# Altium project elevator.PrjPcb
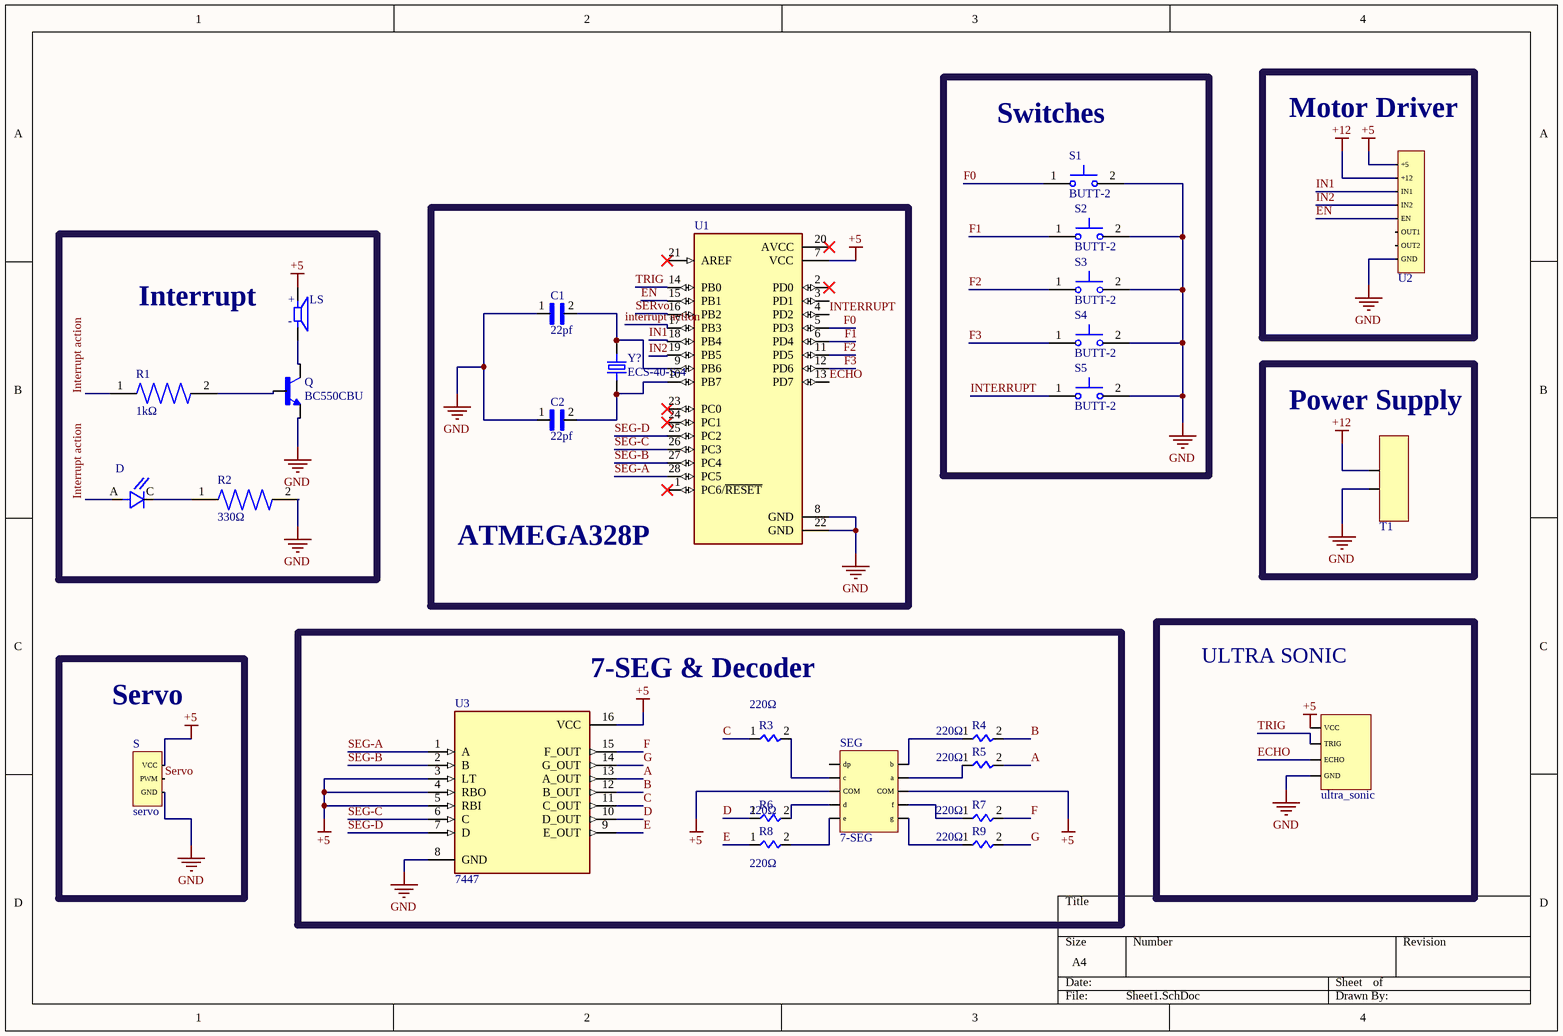
[diagram p0: Sheet1.SchDoc]
1 sheet, 27 parts. Net scope: global (net labels, ports and power ports of the same name join across sheets).
Board file: PCB1.PcbDoc

## Sheet Sheet1.SchDoc
size A4; SheetNumber: 1; SheetTotal: 1

### Parts
C1  22pf  [CAP_RCE5C2A220J0A2H03B]
C2  22pf  [CAP_RCE5C2A220J0A2H03B]
D  OVLAW4CB7  [LEDRD254W50D305H520P]  (value not drawn)
LS  CEM-1206S  [CUI_CEM-1206S]  (value not drawn)
Q  BC550CBU  [TO92-]
R1  1kΩ  [RESAD700W45L350D185]
R2  330Ω  [RESAD700W45L350D185]
R3  220Ω  [RESAD700W45L350D185]
R4  220Ω  [RESAD700W45L350D185]
R5  220Ω  [RESAD700W45L350D185]
R6  220Ω  [RESAD700W45L350D185]
R7  220Ω  [RESAD700W45L350D185]
R8  220Ω  [RESAD700W45L350D185]
R9  220Ω  [RESAD700W45L350D185]
S  servo  [DIP6]
S1  BUTT-2  [SW_BUTT-2]
S2  BUTT-2  [SW_BUTT-2]
S3  BUTT-2  [SW_BUTT-2]
S4  BUTT-2  [SW_BUTT-2]
S5  BUTT-2  [SW_BUTT-2]
S6  ultra_sonic  [DIP8]
SEG  7-SEG  [7seg]
T1  terminal block  [2 PIN]  (value not drawn)
U1  ATMEGA328P-PU  [DIP794W46P254L2967H457Q28B]  (value not drawn)
U2  L298  [DIP16]  (value not drawn)
U3  7447  [DIP794W45P254L1969H508Q16]
Y?  ECS-40-S-4  [XTAL_ECS-40-S-4]

### Blocks framed on the sheet
Switches: S1-S5
Motor Driver: U2
Interrupt: D LS Q R1 R2
ATMEGA328P: C1 C2 U1 Y?
Power Supply: T1
ULTRA SONIC: S6
Servo: S
7-SEG & Decoder: R3-R9 SEG U3

### Nets
+5: LS.P S.3(VCC) S6.4(VCC) SEG.3(COM) SEG.8(COM) U1.7(VCC) U2.1(+5) U3.3(LT) U3.4(RBO) U3.5(RBI) U3.16(VCC)
+12: T1.1 U2.2(+12)
GND: C1.1 C2.1 Q.1(E) R2.2 S.1(GND) S1.2 S2.2 S3.2 S4.2 S5.2 S6.1(GND) T1.2 U1.8(GND) U1.22(GND) U2.8(GND) U3.8(GND)
A: R5.2 U3.13(A_OUT)
B: R4.2 U3.12(B_OUT)
C: R3.1 U3.11(C_OUT)
D: R6.1 U3.10(D_OUT)
E: R8.1 U3.9(E_OUT)
ECHO: S6.2(ECHO) U1.13(PD7)
EN: U1.15(PB1) U2.5(EN)
F: R7.2 U3.15(F_OUT)
F0: S1.1 U1.5(PD3)
F1: S2.1 U1.6(PD4)
F2: S3.1 U1.11(PD5)
F3: S4.1 U1.12(PD6)
G: R9.2 U3.14(G_OUT)
IN1: U1.18(PB4) U2.3(IN1)
IN2: U1.19(PB5) U2.4(IN2)
INTERRUPT: S5.1 U1.4(PD2)
Interrupt action: D.A R1.1 U1.17(PB3)
SEG-A: U1.28(PC5) U3.1(A)
SEG-B: U1.27(PC4) U3.2(B)
SEG-C: U1.26(PC3) U3.6(C)
SEG-D: U1.25(PC2) U3.7(D)
Servo: S.2(PWM) U1.16(PB2)
TRIG: S6.3(TRIG) U1.14(PB0)
NetC1_2: C1.2 U1.9(PB6) Y?.2
NetC2_2: C2.2 U1.10(PB7) Y?.1
NetD_C: D.C R2.1
NetLS_N: LS.N Q.3(C)
NetQ_2: Q.2(B) R1.2
NetR3_2: R3.2 SEG.7(c)
NetR4_1: R4.1 SEG.5(b)
NetR5_1: R5.1 SEG.4(a)
NetR6_2: R6.2 SEG.9(d)
NetR7_1: R7.1 SEG.2(f)
NetR8_2: R8.2 SEG.10(e)
NetR9_1: R9.1 SEG.1(g)

Not connected (* = marked no-connect by the designer): SEG 6(dp); U1 1(PC6/~{RESET})* 2(PD0)* 3(PD1) 20(AVCC)* 21(AREF)* 23(PC0)* 24(PC1)*; U2 6(OUT1) 7(OUT2)

### Notes on the sheet
- (in symbol CEM-1206S) +; -

### Library data of the parts
C1 C2 = RCE5C2A220J0A2H03B: Cap Ceramic 1pF 50V C0G 0.25pF Radial 2.5mm 125C Automotive Bulk; Package: None; Price: None; Value: *; MP: RCE5C2A220J0A2H03B; Availability: Unavailable
D = OVLAW4CB7: White LED Indication - Discrete 3.2V Radial; MF: TT Electronics/Optek; Value: *; SnapEDA_Link: https://www.snapeda.com/parts/OVLAW4CB7/TT%20Electronics/Optek%20Technology/view-part/328075/?ref=snap; Availability: Unavailable; Package: Radial Optek; Price: None; MP: OVLAW4CB7
LS = CEM-1206S: 12 mm, 5 V, 85 dB, Through Hole, Sealed, Magnetic Audio Transducer Buzzer; MF: CUI Devices; Package: TO-220; Value: *; Price: None; MP: CEM-1206S; SnapEDA_Link: https://www.snapeda.com/parts/CEM-1206S/CUI%20Devices/view-part/590537/?ref=snap; Availability: Unavailable
Q = BC550CBU: Bipolar _BJT_ Transistor NPN 45V 100mA 300MHz 500mW Through Hole TO-92-3; MF: ON Semiconductor; MP: BC550CBU; SnapEDA_Link: https://www.snapeda.com/parts/BC550CBU/ON%20Semiconductor/view-part/1852525/?ref=snap; Price: None; Package: TO-92 ON Semiconductor; Value: *; Availability: Unavailable
R1-R9 = 3-1623927-1: 1 MOhms Â±5% 0.25W, 1/4W Through Hole Resistor Axial - Carbon Film; MF: TE Connectivity; Price: None; SnapEDA_Link: https://www.snapeda.com/parts/3-1623927-1/TE+Connectivity/view-part/?ref=snap; Check_prices: https://www.snapeda.com/parts/3-1623927-1/TE+Connectivity/view-part/?ref=eda; Value: *; MP: 3-1623927-1; Package: None; Availability: In Stock
S1-S5 = BUTT-2: Tactile Switches MINI PUSH BUTTON SWITCH 2-PIN QTY. 4; MF: Gravitech; Purchase-URL: https://pricing.snapeda.com/search/part/BUTT-2/?ref=eda; Package: None; Value: *; Check_prices: https://www.snapeda.com/parts/BUTT-2/Gravitech/view-part/?ref=eda; SnapEDA_Link: https://www.snapeda.com/parts/BUTT-2/Gravitech/view-part/?ref=snap; Availability: In Stock; Price: None; MP: BUTT-2
U1 = ATMEGA328P-PU: ATmega Series 20 MHz 32 KB Flash 2 KB SRAM 8-Bit Microcontroller - DIP-28; MP: ATMEGA328P-PU; Package: None; Availability: Unavailable; Price: None; Value: *
U3 = 7447: MP: CD4511BE; Price: None; Availability: Unavailable; Value: *; Package: None
Y? = ECS-40-S-4: Crystal 4MHz Â±30ppm (Tol) Â±50ppm (Stability) Series FUND 150Ohm 2-Pin HC-49/USX Thru-Hole Bulk; MF: ECS Inc.; SnapEDA_Link: https://www.snapeda.com/parts/ECS-40-S-4/ECS+Inc./view-part/?ref=snap; Purchase-URL: https://pricing.snapeda.com/search/part/ECS-40-S-4/?ref=eda; Availability: In Stock; MP: ECS-40-S-4; Value: *; Price: None; Package: HC-49US ECS Inc.; Check_prices: https://www.snapeda.com/parts/ECS-40-S-4/ECS+Inc./view-part/?ref=eda
T1 = terminal block: Parameter 1: *; Parameter 2: *; Parameter 3: *; Parameter 4: *